# Altium project 200226 Precharge Controller R4.PrjPcb (part 2 of 2)

## Sheet PDOC.SchDoc
size A4
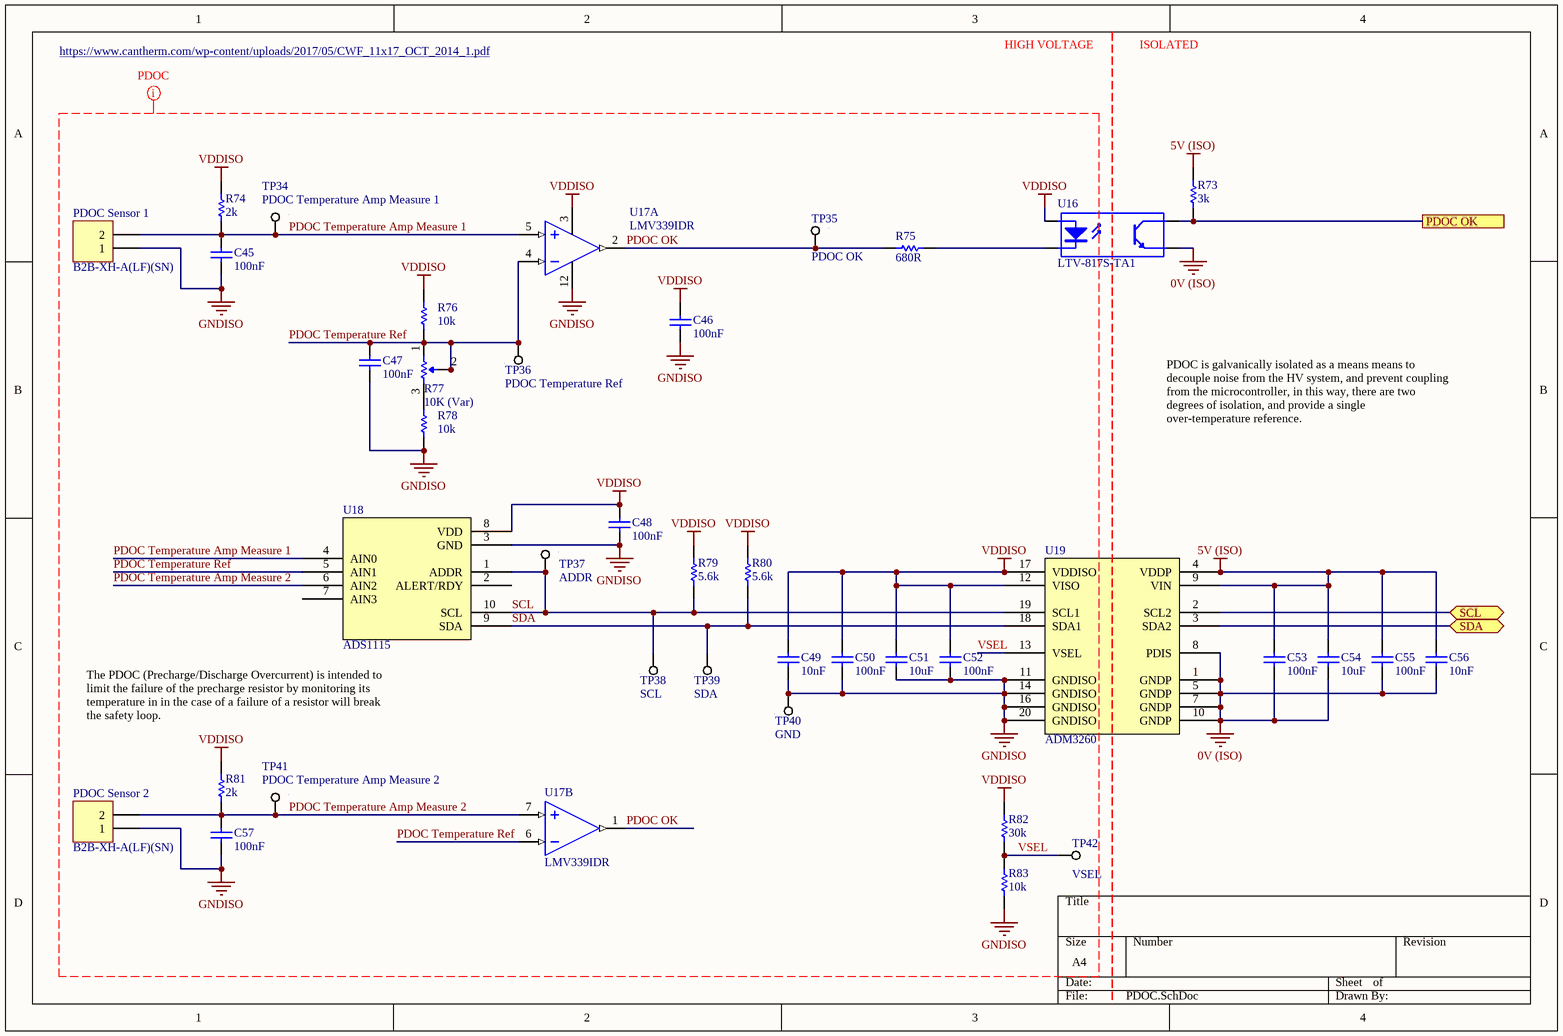
[diagram p7: PDOC.SchDoc]

### Parts
C45  100nF  [0805]
C46  100nF  [0805]
C47  100nF  [0805]
C48  100nF  [0805]
C49  10nF  [0805]
C50  100nF  [0805]
C51  10uF  [0805]
C52  100nF  [0805]
C53  100nF  [0805]
C54  10uF  [0805]
C55  100nF  [0805]
C56  10nF  [0805]
C57  100nF  [0805]
PDOC_Sensor_1  B2B-XH-A(LF)(SN)  [XH 2 PIN VERT]
PDOC_Sensor_2  B2B-XH-A(LF)(SN)  [XH 2 PIN VERT]
R73  3k  [0805]
R74  2k  [0805]
R75  680R  [0805]
R76  10k  [0805]
R77  10K (Var)  [B 3296]
R78  10k  [0805]
R79  5.6k  [0805]
R80  5.6k  [0805]
R81  2k  [0805]
R82  30k  [0805]
R83  10k  [0805]
TP34  PDOC Temperature Amp Measure 1  [SMD Test Point 1mm]
TP35  PDOC OK  [SMD Test Point 1mm]
TP36  PDOC Temperature Ref  [SMD Test Point 1mm]
TP37  ADDR  [SMD Test Point 1mm]
TP38  SCL  [SMD Test Point 1mm]
TP39  SDA  [SMD Test Point 1mm]
TP40  GND  [SMD Test Point 1mm]
TP41  PDOC Temperature Amp Measure 2  [SMD Test Point 1mm]
TP42  VSEL  [SMD Test Point 1mm]
U16  LTV-817S-TA1  [ON 4-SMD]
U17  LMV339IDR  [TI 14-SOIC]  (parts A,B of 4)
U18  ADS1115  [TI 10-VSSOP]
U19  ADM3260  [AD 20-SSOP]

### Ports
PDOC OK, SCL (bidir), SDA (bidir)

### Nets
0V (ISO): C53.1 C54.1 C55.1 C56.1 U16.3(E) U19.1(GNDP) U19.5(GNDP) U19.7(GNDP) U19.8(PDIS) U19.10(GNDP)
5V (ISO): C53.2 C54.2 C55.2 C56.2 R73.2 U19.4(VDDP) U19.9(VIN)
GNDISO: C45.1 C46.1 C47.1 C48.2 C49.1 C50.1 C51.1 C52.2 C57.1 PDOC_Sensor_1.1 PDOC_Sensor_2.1 R78.1 R83.1 TP40.1 U17.12(V-) U18.3(GND) U19.11(GNDISO) U19.14(GNDISO) U19.16(GNDISO) U19.20(GNDISO)  [project net HV Battery-]
VDDISO: C46.2 C48.1 C49.2 C50.2 C51.2 C52.1 R74.2 R76.2 R79.2 R80.2 R81.2 R82.2 U16.1(A) U17.3(V+) U18.8(VDD) U19.12(VISO) U19.17(VDDISO)
PDOC OK: R75.1 TP35.1 U17.1(OUT_B) U17.2(OUT_A)
PDOC OK (ISO): R73.1 U16.4(C) ; port PDOC OK
PDOC Temperature Amp Measure 1: C45.2 PDOC_Sensor_1.2 R74.1 TP34.1 U17.5(IN_A+) U18.4(AIN0)
PDOC Temperature Amp Measure 2: C57.2 PDOC_Sensor_2.2 R81.1 TP41.1 U17.7(IN_B+) U18.6(AIN2)
PDOC Temperature Ref: C47.2 R76.1 R77.1(CCW) R77.2(Wiper) TP36.1 U17.4(IN_A-) U17.6(IN_B-) U18.5(AIN1)
SCL: U19.2(SCL2) ; port SCL
SCL: R79.1 TP37.1 TP38.1 U18.1(ADDR) U18.10(SCL) U19.19(SCL1)  [a separate net that carries the same name]
SDA: U19.3(SDA2) ; port SDA
SDA: R80.1 TP39.1 U18.9(SDA) U19.18(SDA1)  [a separate net that carries the same name]
VSEL: R82.1 R83.2 TP42.1 U19.13(VSEL)
NetR75_2: R75.2 U16.2(K)
NetR77_3: R77.3(CW) R78.2

Not connected (* = marked no-connect by the designer): U18 2(ALERT/RDY) 7(AIN3)

### Layout directives
net class PDOC (ISO): GNDISO, PDOC OK, PDOC Temperature Amp Measure 1, PDOC Temperature Amp Measure 2, PDOC Temperature Ref, SCL, SDA, VDDISO, VSEL

### Notes on the sheet
- https://www.cantherm.com/wp-content/uploads/2017/05/CWF_11x17_OCT_2014_1.pdf
- HIGH VOLTAGE
- ISOLATED
- PDOC is galvanically isolated as a means means to decouple noise from the HV system, and prevent coupling from the microcontroller, in this way, there are two degrees of isolation, and provide a single over-temperature reference.
- The PDOC (Precharge/Discharge Overcurrent) is intended to limit the failure of the precharge resistor by monitoring its temperature in in the case of a failure of a resistor will break the safety loop.

### Library data of the parts
C45-C48 C50 C52 C53 C55 C57 = GCM21BR71H104KA37L: Manufacturer: muRata; Tolerance: ±10%; Material: X7R; Rated Voltage: 50V; Part Number: GCM21BR71H104KA37L; Value: 100nF; Digikey Part Number: 490-6064-1-ND
C49 C56 = GCM2195C1H103JA16D: Manufacturer: muRata; Tolerance: ±5%; Material: C0G, NP0; Rated Voltage: 50V; Part Number: GCM2195C1H103JA16D; Value: 10nF; Digikey Part Number: 490-4783-1-ND
C51 C54 = GRM21BR6YA106KE43L: Manufacturer: muRata; Tolerance: 10%; Material: X5R; Rated Voltage: 50V; Part Number: GRM21BR6YA106KE43L; Value: 10uF; Digikey Part Number: 490-10514-6-ND
PDOC_Sensor_1 PDOC_Sensor_2 = B2B-XH-A(LF)(SN): Positions: 2; Pitch: 2.54mm; Angle: 0; Flange: No; Contact: Tin; Part Number: B2B-XH-A(LF)(SN); Row Spacing: 2.54mm; Digikey Part Number: 455-2247-ND; Digikey Link: https://www.digikey.com.au/en/products/detail/jst-sales-america-inc/B2B-XH-A-LF-SN/1651045
R73 = RC0805FR073KL: Manufacturer: YAGEO; Tolerance: 0.01; Rated Voltage: 0.125W; Part Number: RC0805FR073KL; Value: 3k; Material: FR-07; Digikey Part Number: 311-3.00KCRCT-ND
R74 R81 = RC0805FR072KL: Manufacturer: YAGEO; Tolerance: 0.01; Rated Voltage: 0.125W; Part Number: RC0805FR072KL; Value: 2k; Material: FR-07; Digikey Part Number: 311-2.00KCRCT-ND
R75 = RC0805FR07680RL: Manufacturer: YAGEO; Tolerance: 0.01; Rated Voltage: 0.125W; Part Number: RC0805FR07680RL; Value: 680R; Material: FR-07; Digikey Part Number: 311-680CRCT-ND
R76 R78 R83 = RC0805FR0710KL: Manufacturer: YAGEO; Tolerance: 0.01; Rated Voltage: 0.125W; Part Number: RC0805FR0710KL; Value: 10k; Material: FR-07; Digikey Part Number: 311-10.0KCRCT-ND
R77 = 3296W-1-103LF: Manufacturer: Bournes Inc; Tolerance: 0.1; Rated Voltage: 0.5W; Part Number: 3296W-1-103LF; Value: 10K (Var); Digikey Part Number: 3296W-103LF-ND
R79 R80 = RC0805FR075K6L: Manufacturer: YAGEO; Tolerance: 0.01; Rated Voltage: 0.125W; Part Number: RC0805FR075K6L; Value: 5.6k; Material: FR-07; Digikey Part Number: 311-5.60KCRCT-ND
R82 = RC0805FR0730KL: Manufacturer: YAGEO; Tolerance: 0.01; Rated Voltage: 0.125W; Part Number: RC0805FR0730KL; Value: 30k; Material: FR-07; Digikey Part Number: 311-30.0KCRCT-ND
TP34-TP42 = SMD Test Point Small: Positions: 1; Pitch: 0mm; Row Spacing: 0; Flange: No; Contact: NA; Part Number: SMD Test Point Small; Angle: 0
U16 = LTV-817S-TA1: 35V 50ma Optocoupler (VF=1.2V); Manufacturer: Lite-On Inc; Part Number: LTV-817S-TA1; Digikey Part Number: 160-1893-2-ND; Digikey Link: https://www.digikey.com/product-detail/en/lite-on-inc/LTV-817S-TA1/160-1893-2-ND/388451
U17 = LMV339IDR: Comparator General Purpose Open Collector 14-SOIC; Manufacturer: Texas Instruments; Part Number: LMV339IDR; Digikey Part Number: 296-6611-2-ND; Digikey Link: https://www.digikey.com/product-detail/en/texas-instruments/LMV339MTX-NOPB/296-35446-1-ND/3739150
U18 = ADS1115: 16 Bit Analog to Digital Converter 2, 4 Input 1 Sigma-Delta 10-VSSOP; Manufacturer: Texas Instruments; Part Number: ADS1115; Digikey Part Number: 296-38849-1-ND; Digikey Link: https://www.digikey.com/product-detail/en/texas-instruments/ADS1115IDGSR/296-38849-1-ND/5142969
U19 = ADM3260: I²C Digital Isolator 2500Vrms 2 Channel 25kV/µs CMTI 20-SSOP (0.209", 5.30mm Width); Manufacturer: Analog Devices; Part Number: ADM3260; Digikey Part Number: ADM3260ARSZ-RL7CT-ND; Digikey Link: https://www.digikey.com/product-detail/en/analog-devices-inc/ADM3260ARSZ-RL7/ADM3260ARSZ-RL7CT-ND/5233040

## Nets that join several sheets
0V: Top Level (P1.2), Power Supply (9 pins), Precharge (5 pins), Safety Loops (R32.1 R36.2 R37.2)
0V (ISO): CAN (9 pins), Power Supply (10 pins), Precharge (9 pins), Microcontroller (31 pins), Safety Loops (6 pins), U_Battery_HV Sense (9 pins), U_MC_HV Sense (9 pins), PDOC (10 pins)
3.3V (ISO): CAN (C1.2 C2.2 U1.6), Power Supply (5 pins), Microcontroller (15 pins)
5V: Power Supply (C15.2 D3.A TP5.1 U4.3), Precharge (5 pins)
5V (ISO): CAN (C7.2 C8.2 U1.8), Power Supply (7 pins), Precharge (8 pins), Microcontroller (10 pins), Safety Loops (11 pins), U_Battery_HV Sense (6 pins), U_MC_HV Sense (6 pins), PDOC (7 pins)
12V/24V (Filtered): Top Level (P1.1), Power Supply (7 pins)
AIR Power: Top Level (PRIMARY_INTERFACE1.12 PRIMARY_INTERFACE1.13 PRIMARY_INTERFACE1.17), Precharge (7 pins)
GLV-: Top Level (PRIMARY_INTERFACE1.1 PRIMARY_INTERFACE1.11 PRIMARY_INTERFACE1.16 PRIMARY_INTERFACE1.20), Power Supply (C16.1 D2.A TP9.1 U7.4), Precharge (6 pins)
HV Battery-: Top Level (HV_BATTERY-1.1 HV_BATTERY-1.2 HV_MC-1.1 HV_MC-1.2), U_Battery_HV Sense (14 pins), U_MC_HV Sense (13 pins), PDOC (20 pins)
VDDISO: U_Battery_HV Sense (12 pins), U_MC_HV Sense (13 pins), PDOC (17 pins)
AIR+: Top Level (PRIMARY_INTERFACE1.15), Precharge (D11.A D12.K Q3.D)
AIR+ (ISO): Precharge (R28.2 U9.3), Microcontroller (U15.31)
AIR+ Feedback (ISO): Precharge (R26.1 TP16.1), Microcontroller (U15.22)
AIR+ Feedback Out: Top Level (PRIMARY_INTERFACE1.14), Precharge (R24.1 U10.7)
AIR-: Top Level (PRIMARY_INTERFACE1.19), Precharge (D7.A D8.K Q1.D)
AIR- (ISO): Precharge (R14.2 U9.2), Microcontroller (U15.29)
AIR- Feedback (ISO): Precharge (R12.1 TP13.1), Microcontroller (U15.21)
AIR- Feedback Out: Top Level (PRIMARY_INTERFACE1.5 PRIMARY_INTERFACE1.18), Precharge (R10.1 U10.5)
AMS OK (ISO): Microcontroller (U15.26), Safety Loops (R39.1 R40.2 TP21.1)
CAN RX: CAN (U1.4), Microcontroller (R62.1 TP31.1 U15.45)
CAN TX: CAN (U1.5), Microcontroller (R63.1 TP32.1 U15.46)
CAN_N: Top Level (PRIMARY_INTERFACE1.4), CAN (C10.2 CAN_TERM_R2.1 TP2.1 U2.1)
CAN_P: Top Level (PRIMARY_INTERFACE1.6), CAN (C11.2 CAN_TERM_R1.2 TP3.1 U2.2)
CANS: Top Level (PRIMARY_INTERFACE1.3), CAN (15 pins)
GLV+: Top Level (PRIMARY_INTERFACE1.2), Power Supply (F1.1 TP6.1)
Green In: Top Level (PRIMARY_INTERFACE1.7), Safety Loops (IMD_Bypass1.2 K1.9)
Green Out: Top Level (PRIMARY_INTERFACE1.8), Safety Loops (K3.13 PDOC_Bypass1.1)
HV Battery+: Top Level (HV_BATTERY+1.1 HV_BATTERY+1.2), Precharge (R21.1), U_Battery_HV Sense (R43_U_Battery_HV_Sense.2)
HV MC+: Top Level (HV_MC+1.1 HV_MC+1.2), Precharge (R16.2), U_MC_HV Sense (R43_U_MC_HV_Sense.2)
IMD Data: Top Level (P1.5), Safety Loops (D15.A TP20.1 U10.3)
IMD Data (ISO): Microcontroller (U15.38), Safety Loops (R34.1)
IMD OK: Top Level (P1.3), Safety Loops (TP19.1 U10.1)
IMD OK (ISO): Microcontroller (U15.25), Safety Loops (Q4.G R31.1 R33.2 TP18.1)
NetR5_1: Precharge (R5.1 TP12.1), Microcontroller (U15.39)
PDOC OK (ISO): Microcontroller (U15.28), Safety Loops (R42.1 TP22.1), PDOC (R73.1 U16.4)
Precharge Relay (ISO): Precharge (R20.1 R22.2 TP15.1), Microcontroller (U15.30)
SCL: Microcontroller (R60.1 TP29.1 U15.42), U_Battery_HV Sense (U14_U_Battery_HV_Sense.2), U_MC_HV Sense (U14_U_MC_HV_Sense.2), PDOC (U19.2)
SDA: Microcontroller (R61.1 TP30.1 U15.43), U_Battery_HV Sense (U14_U_Battery_HV_Sense.3), U_MC_HV Sense (U14_U_MC_HV_Sense.3), PDOC (U19.3)